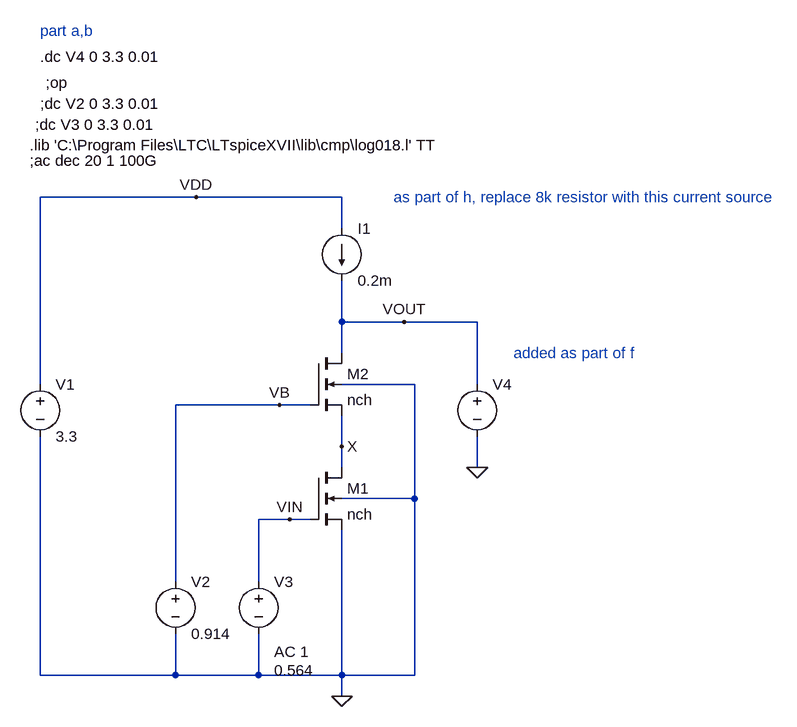
[diagram p0: schematic Draft3.asc]
Draft3.asc, the LTspice schematic file:
Version 4
SHEET 1 932 680
WIRE -16 -384 -256 -384
WIRE 208 -384 -16 -384
WIRE 208 -336 208 -384
WIRE 208 -192 208 -256
WIRE 304 -192 208 -192
WIRE 416 -192 304 -192
WIRE 208 -144 208 -192
WIRE -256 -96 -256 -384
WIRE 320 -96 208 -96
WIRE 416 -96 416 -192
WIRE 112 -64 -48 -64
WIRE 160 -64 112 -64
WIRE 208 0 208 -48
WIRE 208 32 208 0
WIRE 416 32 416 -16
WIRE 320 80 320 -96
WIRE 320 80 208 80
WIRE 128 112 80 112
WIRE 160 112 128 112
WIRE -48 208 -48 -64
WIRE 80 208 80 112
WIRE -256 352 -256 -16
WIRE -48 352 -48 288
WIRE -48 352 -256 352
WIRE 80 352 80 288
WIRE 80 352 -48 352
WIRE 208 352 208 128
WIRE 208 352 80 352
WIRE 320 352 320 80
WIRE 320 352 208 352
WIRE 208 384 208 352
FLAG 208 384 0
FLAG 304 -192 VOUT
FLAG -16 -384 VDD
FLAG 112 -64 VB
FLAG 128 112 VIN
FLAG 208 0 X
FLAG 416 32 0
SYMBOL nmos4 160 32 R0
SYMATTR InstName M1
SYMATTR Value nch
SYMATTR Value2 l=0.18u w=18u
SYMBOL nmos4 160 -144 R0
SYMATTR InstName M2
SYMATTR Value nch
SYMATTR Value2 l=0.36u w=18u
SYMBOL voltage -256 -112 R0
WINDOW 123 0 0 Left 0
WINDOW 39 0 0 Left 0
SYMATTR InstName V1
SYMATTR Value 3.3
SYMBOL voltage -48 192 R0
WINDOW 123 0 0 Left 0
WINDOW 39 0 0 Left 0
SYMATTR InstName V2
SYMATTR Value 0.914
SYMBOL voltage 80 192 R0
WINDOW 3 24 152 Left 2
WINDOW 123 24 124 Left 2
WINDOW 39 0 0 Left 0
SYMATTR Value 0.564
SYMATTR Value2 AC 1
SYMATTR InstName V3
SYMBOL voltage 416 -112 R0
WINDOW 123 0 0 Left 0
WINDOW 39 0 0 Left 0
SYMATTR InstName V4
SYMATTR Value ""
SYMBOL current 208 -336 R0
WINDOW 123 0 0 Left 0
WINDOW 39 0 0 Left 0
SYMATTR InstName I1
SYMATTR Value 0.2m
TEXT -272 -464 Left 2 !.lib 'C:\\Program Files\\LTC\\LTspiceXVII\\lib\\cmp\\log018.l' TT
TEXT -272 -440 Left 2 !;ac dec 20 1 100G
TEXT -256 -640 Left 2 ;part a,b
TEXT -264 -496 Left 2 !;dc V3 0 3.3 0.01
TEXT -256 -528 Left 2 !;dc V2 0 3.3 0.01
TEXT -248 -560 Left 2 !;op
TEXT -256 -600 Left 2 !.dc V4 0 3.3 0.01
TEXT 472 -144 Left 2 ;added as part of f
TEXT 288 -384 Left 2 ;as part of h, replace 8k resistor with this current source

The netlist it stands for:
* Draft3.asc
M1 X VIN 0 0 nch l=0.18u w=18u
M2 VOUT VB X 0 nch l=0.36u w=18u
V1 VDD 0 3.3
V2 VB 0 0.914
V3 VIN 0 0.564 AC 1
V4 VOUT 0
I1 VDD VOUT 0.2m
.model NMOS NMOS
.model PMOS PMOS
.lib standard.mos
.lib 'C:\Program Files\LTC\LTspiceXVII\lib\cmp\log018.l' TT
;ac dec 20 1 100G
* part a,b
;dc V3 0 3.3 0.01
;dc V2 0 3.3 0.01
;op
.dc V4 0 3.3 0.01
* added as part of f
* as part of h, replace 8k resistor with this current source
.backanno
.end

* Results of the author's LTspice run, read from the files saved beside the schematic
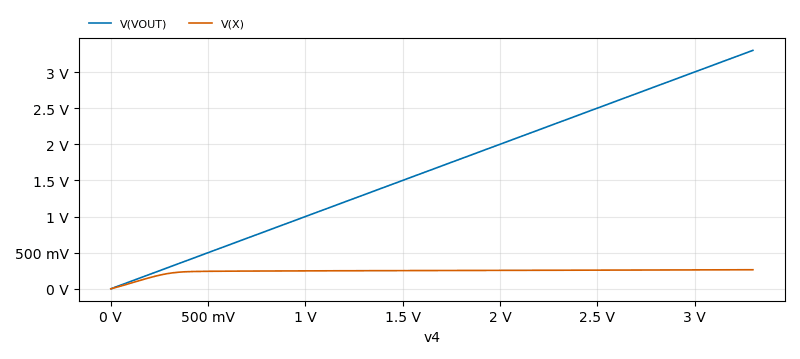
[diagram p1: DC transfer characteristic of Draft3.asc, plotted from the saved traces]
* DC transfer characteristic, 1 run:
*   V(VOUT): 0 V at v4=0 V, 3.3 V at v4=3.3 V, min 0 V, max 3.3 V
*   V(X): -55.72 fV at v4=0 V, 263.6 mV at v4=3.3 V, min -55.72 fV, max 263.6 mV